# Altium schematic sheet power_display.SchDoc
size A3; SheetNumber: 4; SheetTotal: 6
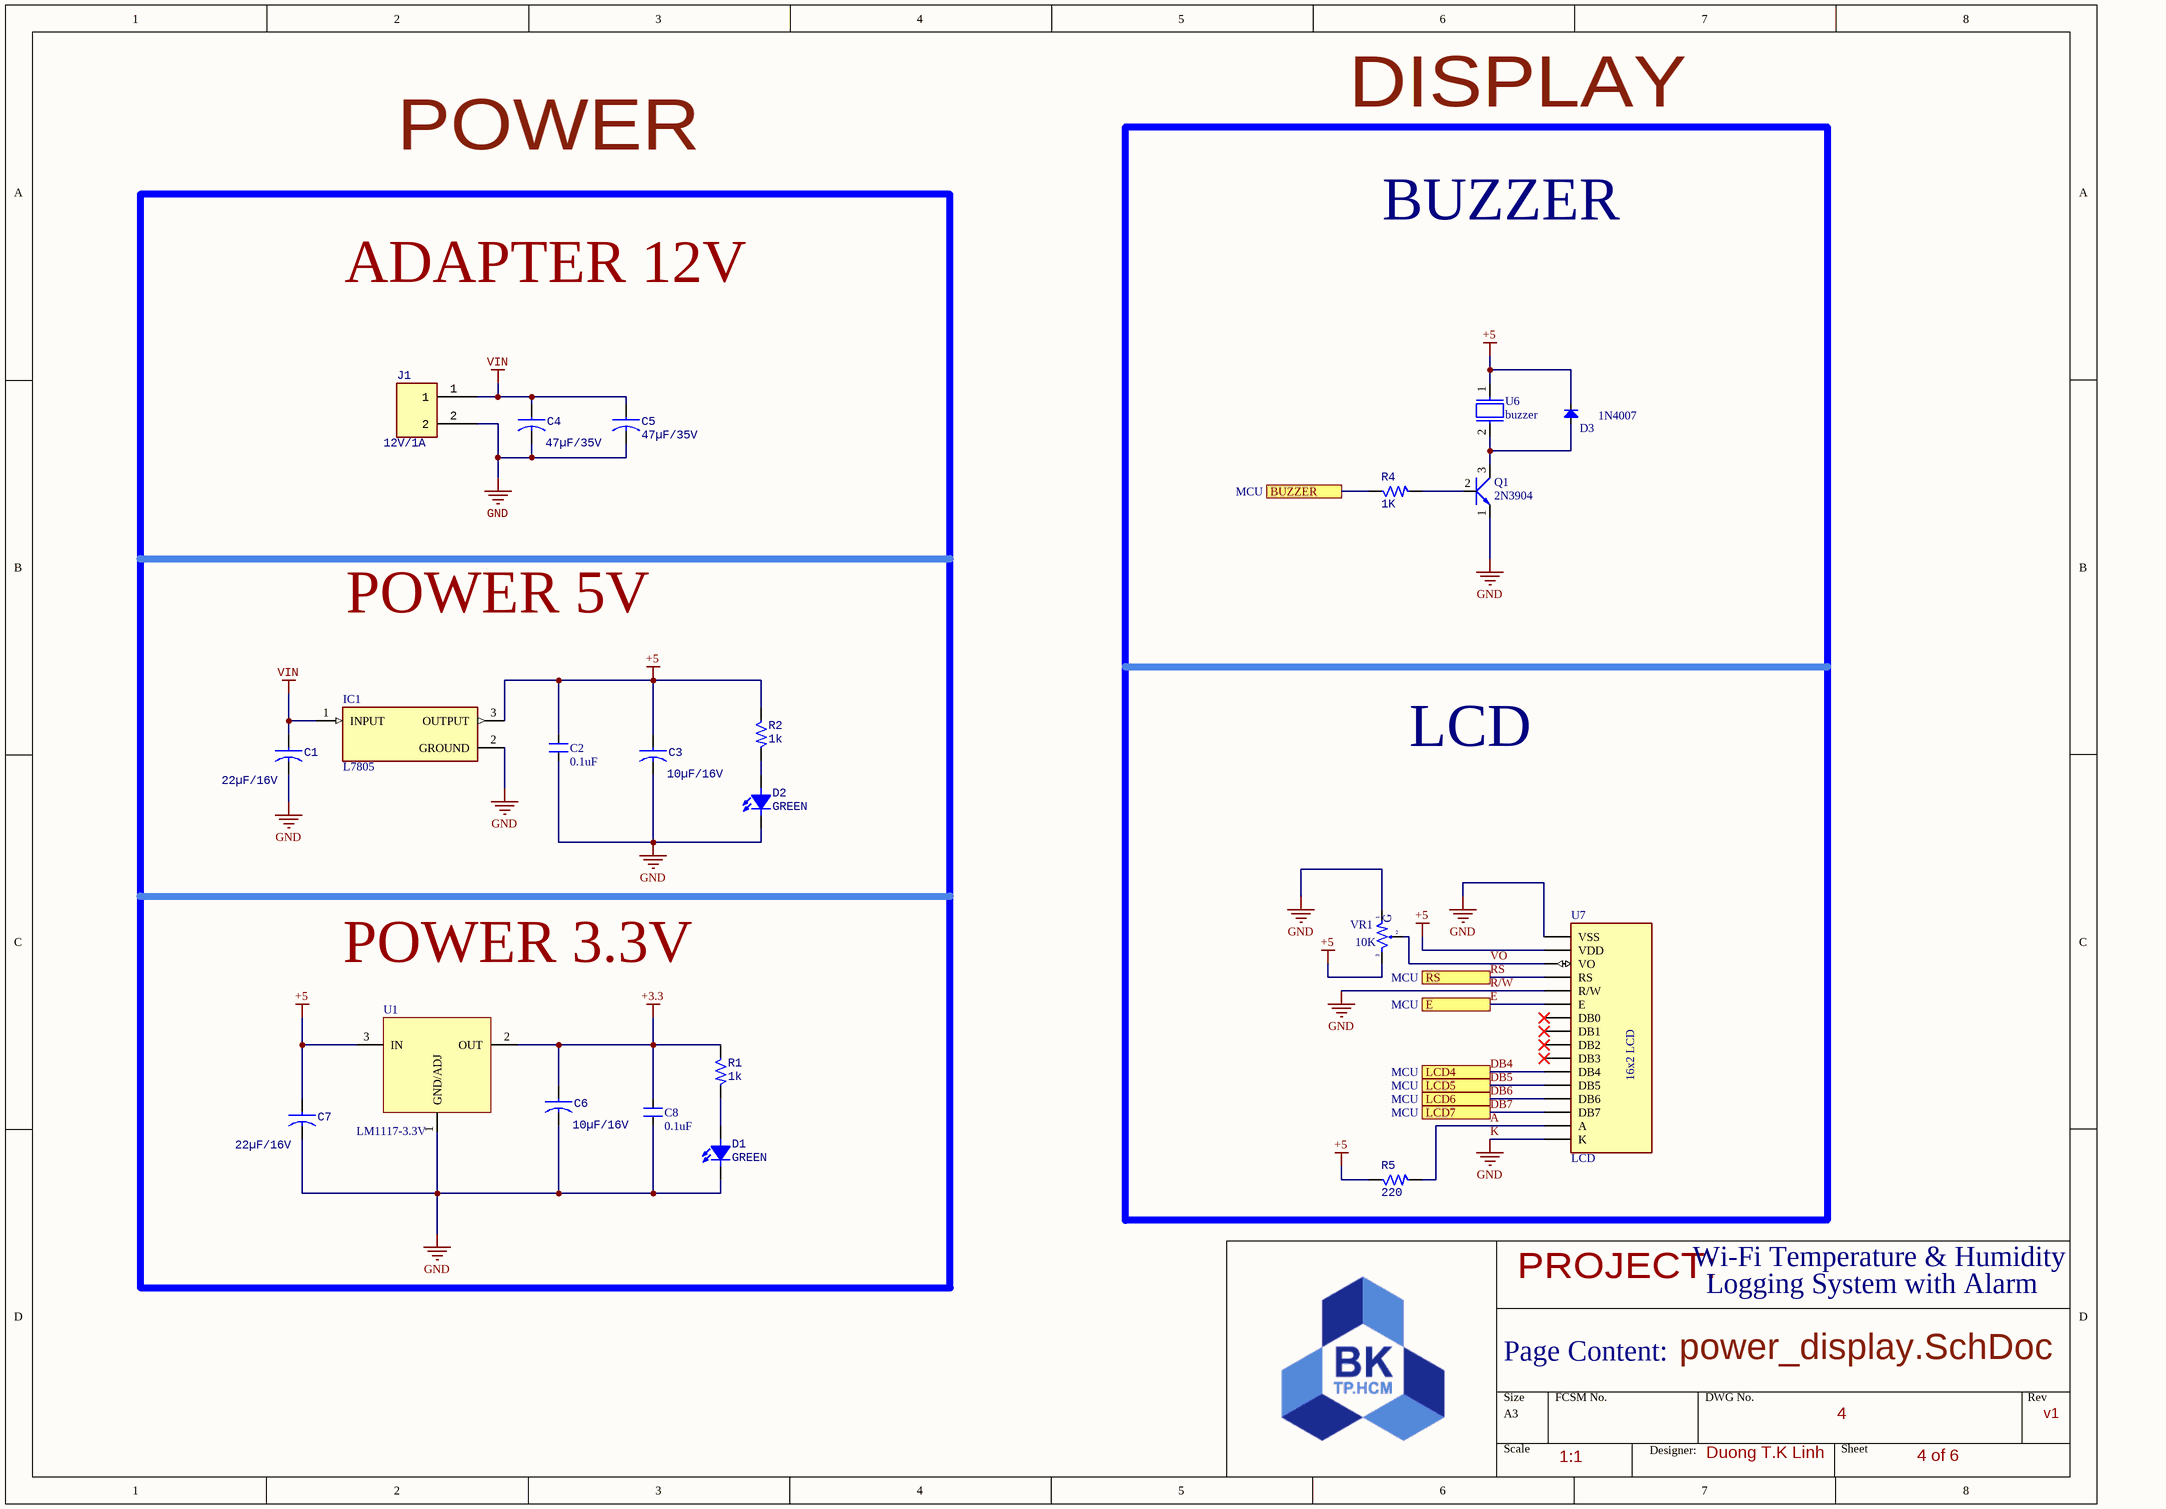
[diagram p0: power_display.SchDoc]

## Parts
C1  22µF/16V  [CP1/2]
C2  0.1uF  [CN2]
C3  10µF/16V  [CP1/2]
C4  47µF/35V  [CP1/2]
C5  47µF/35V  [CP1/2]
C6  10µF/16V  [CP1/2]
C7  22µF/16V  [CP1/2]
C8  0.1uF  [CN2]
D1  GREEN  [LED-5TRED]
D2  GREEN  [LED-5TRED]
D3  Diode  [DIO-1A]  (value not drawn)
IC1  L7805  [L7805]
J1  12V/1A  [J2-D1T]
Q1  2N3904  [TO92-123]
R1  1k  [RES-1/4W-SMALL]
R2  1k  [RES-1/4W-SMALL]
R4  1K  [RES-1/4W-SMALL]
R5  220  [RES-1/4W-SMALL]
U1  LM1117-3.3V  [TO220-123]
U6  buzzer  [buzzer]
U7  LCD  [LCD]
VR1  10K  [VR-S1]

## Blocks framed on the sheet
DISPLAY: D3 Q1 R4 R5 U6 U7 VR1

## Ports
BUZZER (see MCU), E (see MCU), LCD4 (see MCU), LCD5 (see MCU), LCD6 (see MCU), LCD7 (see MCU), RS (see MCU)

## Nets
+3.3: C6.1 C8.2 R1.1 U1.2(OUT)
+5: C2.2 C3.1 C7.1 D3.2(K) IC1.3(OUTPUT) R2.1 R5.1 U1.3(IN) U6.1 U7.2(VDD) VR1.3
K: C1.2 C2.1 C3.2 C4.2 C5.2 C6.2 C7.2 C8.1 D1.2(K) D2.2(K) IC1.2(GROUND) J1.2 Q1.1(E) U1.1(GND/ADJ) U7.1(VSS) U7.5(R/W) U7.16(K) VR1.1  [also labelled GND, R/W]
VIN: C1.1 C4.1 C5.1 IC1.1(INPUT) J1.1
A: R5.2 U7.15(A)
BUZZER: R4.1 ; port BUZZER
DB4: U7.11(DB4) ; port LCD4
DB5: U7.12(DB5) ; port LCD5
DB6: U7.13(DB6) ; port LCD6
DB7: U7.14(DB7) ; port LCD7
E: U7.6(E) ; port E
RS: U7.4(RS) ; port RS
VO: U7.3(VO) VR1.2
NetD1_1: D1.1(A) R1.2
NetD2_1: D2.1(A) R2.2
NetD3_1: D3.1(A) Q1.3(C) U6.2
NetQ1_2: Q1.2(B) R4.2

Not connected (* = marked no-connect by the designer): U7 7(DB0)* 8(DB1)* 9(DB2)* 10(DB3)*

## Notes on the sheet
- POWER
- BUZZER
- ADAPTER 12V
- (near D3) 1N4007
- POWER 5V
- LCD
- POWER 3.3V
- PROJECT:
- Wi-Fi Temperature & Humidity
- Logging System with Alarm
- Page Content:
- power_display.SchDoc
- 1:1
- Designer:
- Duong T.K Linh
- 4
- 4 of 6
- v1
- (in symbol LCD) 16x2 LCD
- (in symbol VR-S) G

## Library data of the parts
C1 C3 C6 C7 = ID-4: Mfr# #: EEH-ZA1V470P; VALUE: 47µF/35V; Design Item ID: ID-4
C2 C8 = CN2: Cap np 104 => 105pF; Value: 0.1uF
C4 C5 = ID-4: Mfr# #: EEH-ZA1V470P; Design Item ID: ID-4; VALUE: 47µF/35V
D1 D2 = ID-23: Green 569nm LED Indication - Discrete 2.1V 0603 (1608 Metric); Mfr# #: LTST-C190GKT; Design Item ID: ID-23; Value: GREEN
D3 = Diode: Default Diode; Code - JEDEC: DO-214-AB; Value: 1N5007; Published: 8-Jun-2000; Revision: July-2002: Re-released for DXP Platform.; Publisher: Altium Limited
J1 = ID-36: 2 Position Wire to Board Terminal Block Horizontal with Board 0.200" (5.08mm) Through Hole; Mfr# #: VI0221520000G; Design Item ID: ID-36
Q1 = 2N904: NPN 600mW, ECB; Value: C1815
R1 R2 R4 R5 = RES-SMD
U1 = LM1117: Low-Dropout Linear Regulator; Creator: Nguyen Ba Bien; Website: http://group3i.net
VR1 = VR-S: Var Resistor; Value: Volume 50k